# Altium project iMX53_BB_PCB_V1I1.PrjPcb (part 2 of 2)

## Sheet [08] MMC SLOT.SchDoc
size A3; CompanyName: FPT-FTI copporation; Address1: FPT Building Duy Tan; Address2: Floor 4,; DocumentNumber: 8; SheetNumber: 8; SheetTotal: 13; NameAuthor: Angle Vu
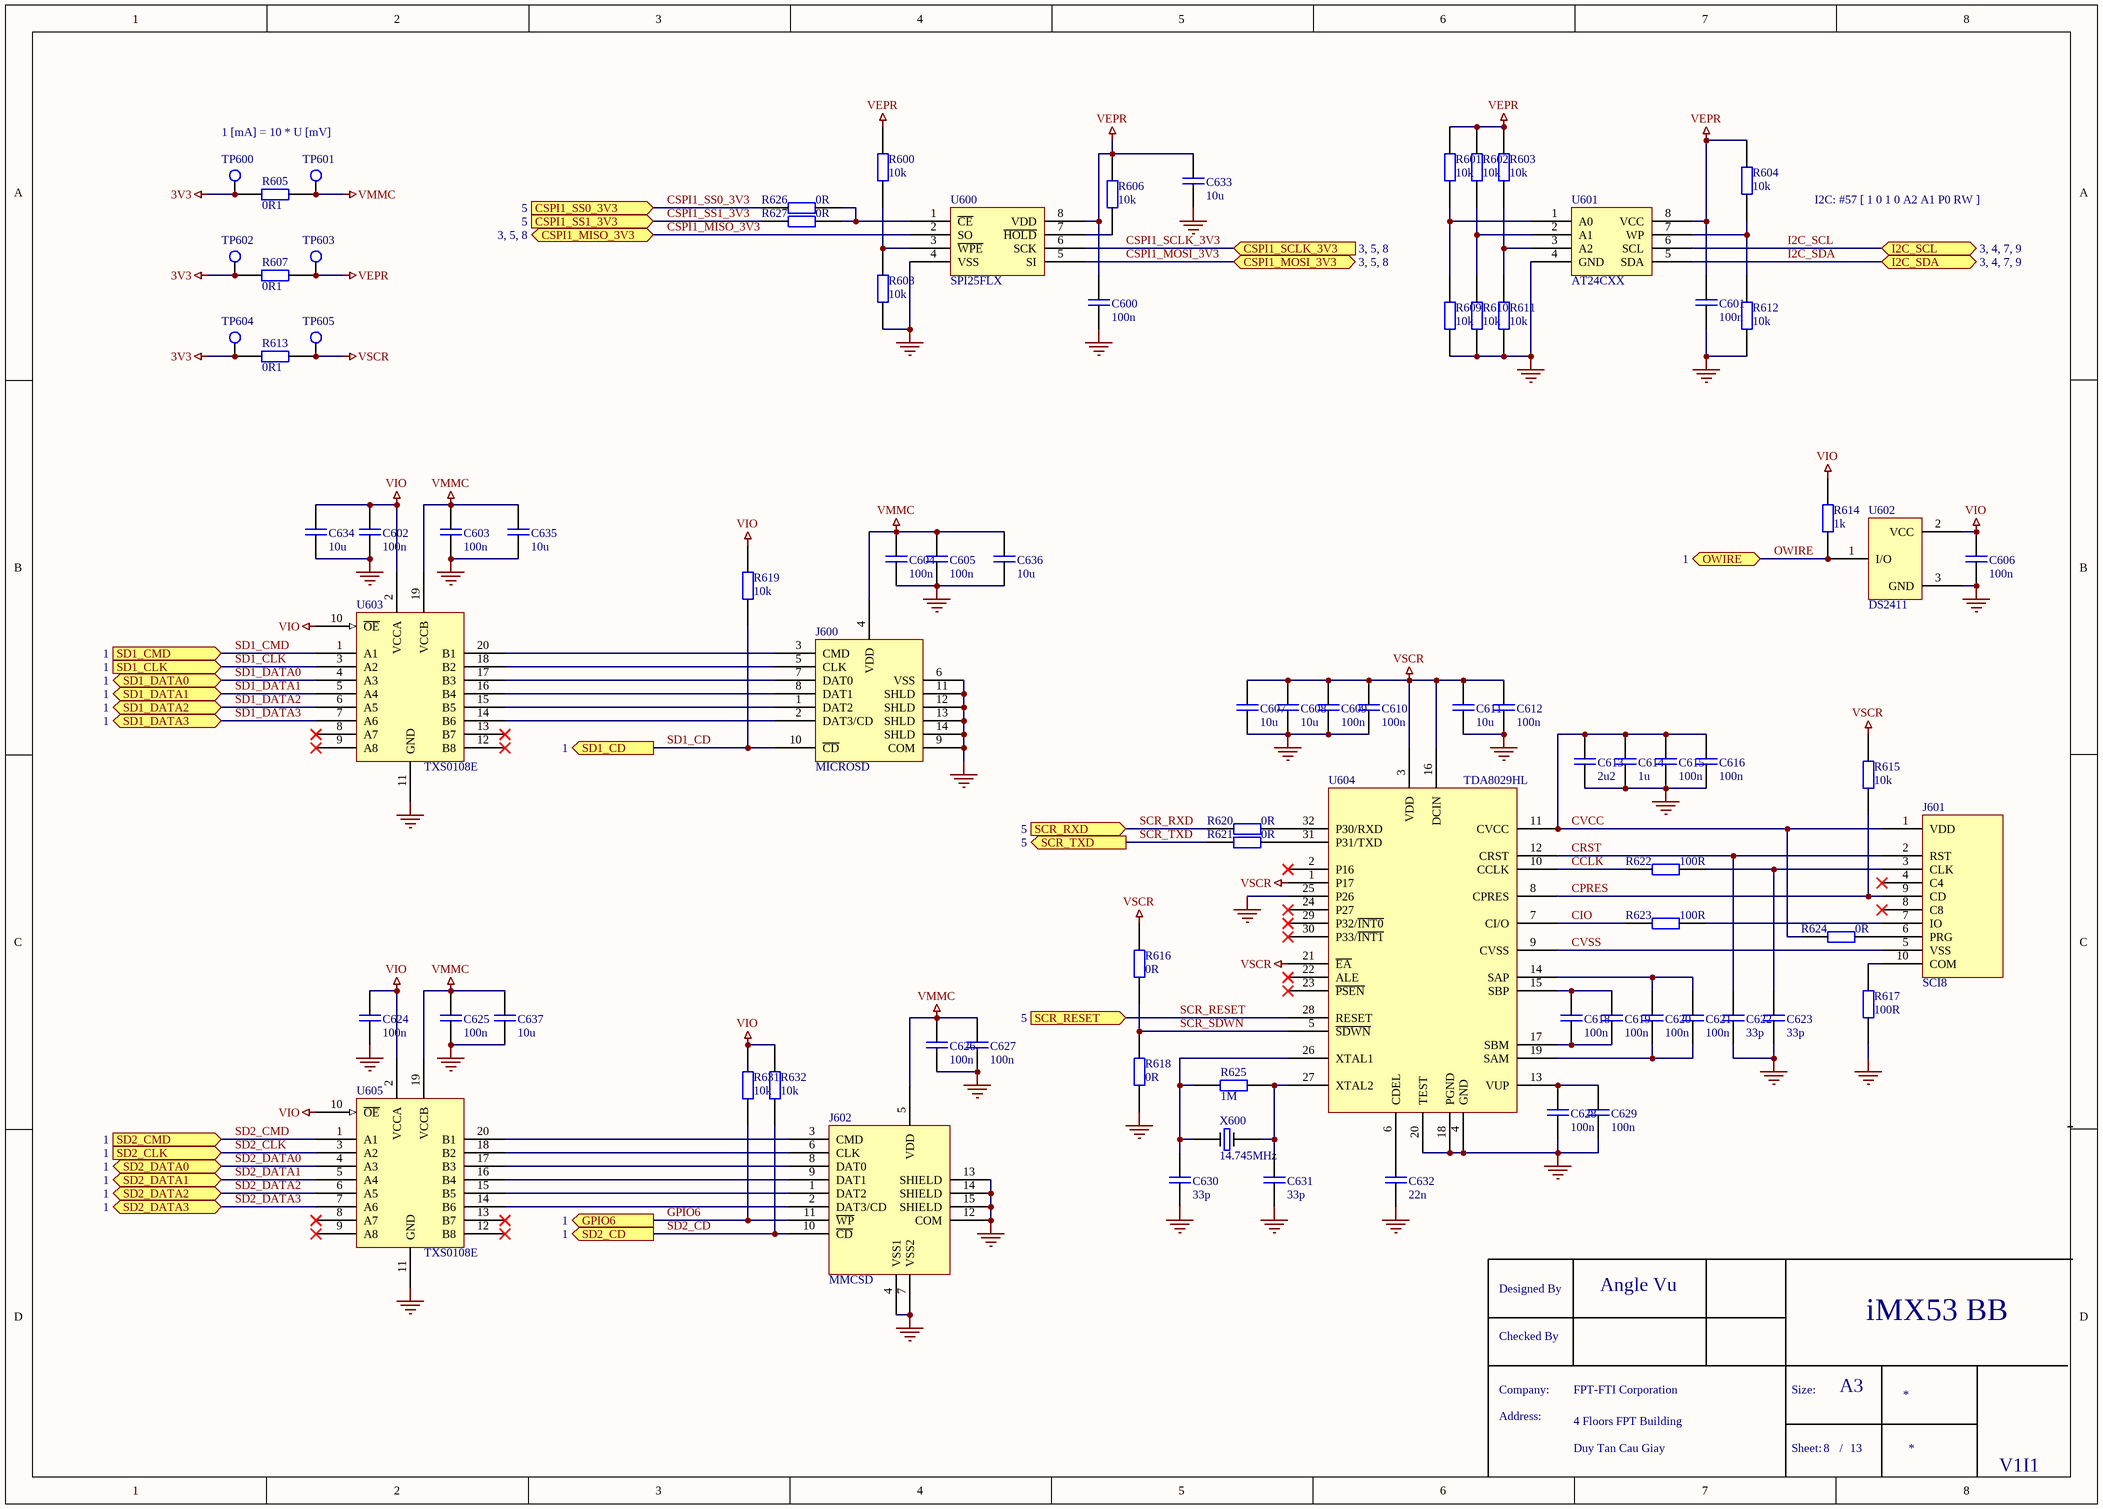
[diagram p8: [08] MMC SLOT.SchDoc]

### Parts
C600  100n  [0603]
C601  100n  [0603]
C602  100n  [0603]
C603  100n  [0603]
C604  100n  [0603]
C605  100n  [0603]
C606  100n  [0603]
C607  10u  [0805]
C608  10u  [0805]
C609  100n  [0603]
C610  100n  [0603]
C611  10u  [0805]
C612  100n  [0603]
C613  2u2  [0603]
C614  1u  [0603]
C615  100n  [0603]
C616  100n  [0603]
C618  100n  [0603]
C619  100n  [0603]
C620  100n  [0603]
C621  100n  [0603]
C622  33p  [0603]
C623  33p  [0603]
C624  100n  [0603]
C625  100n  [0603]
C626  100n  [0603]
C627  100n  [0603]
C628  100n  [0603]
C629  100n  [0603]
C630  33p  [0603]
C631  33p  [0603]
C632  22n  [0603]
C633  10u  [0805]
C634  10u  [0805]
C635  10u  [0805]
C636  10u  [0805]
C637  10u  [0805]
J600  MICROSD  [uSD10]
J601  SCI8  [SCI8F]
J602  MMCSD  [SDCMF-109]
R600  10k  [0603]
R601  10k  [0603]
R602  10k  [0603]
R603  10k  [0603]
R604  10k  [0603]
R605  0R1  [0603]
R606  10k  [0603]
R607  0R1  [0603]
R608  10k  [0603]
R609  10k  [0603]
R610  10k  [0603]
R611  10k  [0603]
R612  10k  [0603]
R613  0R1  [0603]
R614  1k  [0603]
R615  10k  [0603]
R616  0R  [0603]
R617  100R  [0603]
R618  0R  [0603]
R619  10k  [0603]
R620  0R  [0603]
R621  0R  [0603]
R622  100R  [0603]
R623  100R  [0603]
R624  0R  [0603]
R625  1M  [0603]
R626  0R  [0603]
R627  0R  [0603]
R631  10k  [0603]
R632  10k  [0603]
TP600  TESTPOINT  [TESTPOINT_2mm]  (value not drawn)
TP601  TESTPOINT  [TESTPOINT_2mm]  (value not drawn)
TP602  TESTPOINT  [TESTPOINT_2mm]  (value not drawn)
TP603  TESTPOINT  [TESTPOINT_2mm]  (value not drawn)
TP604  TESTPOINT  [TESTPOINT_2mm]  (value not drawn)
TP605  TESTPOINT  [TESTPOINT_2mm]  (value not drawn)
U600  SPI25FLX  [SOIC8]
U601  AT24CXX  [SOIC8]
U602  DS2411  [SOT23]
U603  TXS0108E  [TSSOP20]
U604  TDA8029HL  [LQFP32]
U605  TXS0108E  [TSSOP20]
X600  14.745MHz  [HC494H]

### Ports
CSPI1_MISO_3V3 (bidir, see 3, 5, 8), CSPI1_MOSI_3V3 (bidir, see 3, 5, 8), CSPI1_SCLK_3V3 (in, see 3, 5, 8), CSPI1_SS0_3V3 (in, see 5), CSPI1_SS1_3V3 (in, see 5), GPIO6 (out, see 1), I2C_SCL (bidir, see 3, 4, 7, 9), I2C_SDA (bidir, see 3, 4, 7, 9), OWIRE (bidir, see 1), SCR_RESET (in, see 5), SCR_RXD (in, see 5), SCR_TXD (out, see 5), SD1_CD (out, see 1), SD1_CLK (in, see 1), SD1_CMD (in, see 1), SD1_DATA0 (bidir, see 1), SD1_DATA1 (bidir, see 1), SD1_DATA2 (bidir, see 1), SD1_DATA3 (bidir, see 1), SD2_CD (out, see 1), SD2_CLK (in, see 1), SD2_CMD (in, see 1), SD2_DATA0 (bidir, see 1), SD2_DATA1 (bidir, see 1), SD2_DATA2 (bidir, see 1), SD2_DATA3 (bidir, see 1)

### Nets
3V3: R605.1 R607.1 R613.1 TP600.1 TP602.1 TP604.1
GND: C600.1 C601.1 C602.1 C603.1 C604.1 C605.1 C606.1 C607.1 C608.1 C609.1 C610.1 C611.1 C612.1 C613.1 C614.1 C615.1 C616.1 C622.1 C623.1 C624.1 C625.1 C626.1 C627.1 C628.1 C629.1 C630.1 C631.1 C632.1 C633.1 C634.1 C635.1 C636.1 C637.1 J600.6(VSS) J600.9(COM) J600.11(SHLD) J600.12(SHLD) J600.13(SHLD) J600.14(SHLD) J602.4(VSS1) J602.7(VSS2) J602.12(COM) J602.13(SHIELD) J602.14(SHIELD) J602.15(SHIELD) R608.2 R609.2 R610.2 R611.2 R612.2 R617.1 R618.1 U600.4(VSS) U601.4(GND) U602.3(GND) U603.11(GND) U604.4(GND) U604.18(PGND) U604.20(TEST) U604.25(P26) U605.11(GND)
VEPR: C600.2 C601.2 C633.2 R600.1 R601.1 R602.1 R603.1 R604.1 R606.1 R607.2 TP603.1 U600.8(VDD) U601.8(VCC)
VIO: C602.2 C606.2 C624.2 C634.2 R614.1 R619.1 R631.1 R632.1 U602.2(VCC) U603.2(VCCA) U603.10(~{OE}) U605.2(VCCA) U605.10(~{OE})
VMMC: C603.2 C604.2 C605.2 C625.2 C626.2 C627.2 C635.2 C636.2 C637.2 J600.4(VDD) J602.5(VDD) R605.2 TP601.1 U603.19(VCCB) U605.19(VCCB)
VSCR: C607.2 C608.2 C609.2 C610.2 C611.2 C612.2 R613.2 R615.2 R616.2 TP605.1 U604.1(P17) U604.3(VDD) U604.16(DCIN) U604.21(~{EA})
CCLK: R622.1 U604.10(CCLK)
CIO: R623.1 U604.7(CI/O)
CPRES: J601.9(CD) R615.1 U604.8(CPRES)
CRST: C622.2 J601.2(RST) U604.12(CRST)
CSPI1_MISO_3V3: U600.2(SO) ; port CSPI1_MISO_3V3
CSPI1_MOSI_3V3: U600.5(SI) ; port CSPI1_MOSI_3V3
CSPI1_SCLK_3V3: U600.6(SCK) ; port CSPI1_SCLK_3V3
CSPI1_SS0_3V3: R626.1 ; port CSPI1_SS0_3V3
CSPI1_SS1_3V3: R627.1 ; port CSPI1_SS1_3V3
CVCC: C613.2 C614.2 C615.2 C616.2 J601.1(VDD) R624.1 U604.11(CVCC)
CVSS: J601.5(VSS) U604.9(CVSS)
GPIO6: J602.11(~{WP}) R631.2 ; port GPIO6
I2C_SCL: U601.6(SCL) ; port I2C_SCL
I2C_SDA: U601.5(SDA) ; port I2C_SDA
OWIRE: R614.2 U602.1(I/O) ; port OWIRE
SCR_RESET: U604.28(RESET) ; port SCR_RESET
SCR_RXD: R620.1 ; port SCR_RXD
SCR_SDWN: R616.1 R618.2 U604.5(~{SDWN})
SCR_TXD: R621.1 ; port SCR_TXD
SD1_CD: J600.10(~{CD}) R619.2 ; port SD1_CD
SD1_CLK: U603.3(A2) ; port SD1_CLK
SD1_CMD: U603.1(A1) ; port SD1_CMD
SD1_DATA0: U603.4(A3) ; port SD1_DATA0
SD1_DATA1: U603.5(A4) ; port SD1_DATA1
SD1_DATA2: U603.6(A5) ; port SD1_DATA2
SD1_DATA3: U603.7(A6) ; port SD1_DATA3
SD2_CD: J602.10(~{CD}) R632.2 ; port SD2_CD
SD2_CLK: U605.3(A2) ; port SD2_CLK
SD2_CMD: U605.1(A1) ; port SD2_CMD
SD2_DATA0: U605.4(A3) ; port SD2_DATA0
SD2_DATA1: U605.5(A4) ; port SD2_DATA1
SD2_DATA2: U605.6(A5) ; port SD2_DATA2
SD2_DATA3: U605.7(A6) ; port SD2_DATA3
NetC618_1: C618.1 C619.1 U604.17(SBM)
NetC618_2: C618.2 C619.2 U604.15(SBP)
NetC620_1: C620.1 C621.1 U604.19(SAM)
NetC620_2: C620.2 C621.2 U604.14(SAP)
NetC623_2: C623.2 J601.3(CLK) R622.2
NetC628_2: C628.2 C629.2 U604.13(VUP)
NetC630_2: C630.2 R625.2 U604.26(XTAL1) X600.1
NetC631_2: C631.2 R625.1 U604.27(XTAL2) X600.2
NetC632_2: C632.2 U604.6(CDEL)
NetJ600_1: J600.1(DAT2) U603.15(B5)
NetJ600_2: J600.2(DAT3/CD) U603.14(B6)
NetJ600_3: J600.3(CMD) U603.20(B1)
NetJ600_5: J600.5(CLK) U603.18(B2)
NetJ600_7: J600.7(DAT0) U603.17(B3)
NetJ600_8: J600.8(DAT1) U603.16(B4)
NetJ601_6: J601.6(PRG) R624.2
NetJ601_7: J601.7(IO) R623.2
NetJ601_10: J601.10(COM) R617.2
NetJ602_1: J602.1(DAT2) U605.15(B5)
NetJ602_2: J602.2(DAT3/CD) U605.14(B6)
NetJ602_3: J602.3(CMD) U605.20(B1)
NetJ602_6: J602.6(CLK) U605.18(B2)
NetJ602_8: J602.8(DAT0) U605.17(B3)
NetJ602_9: J602.9(DAT1) U605.16(B4)
NetR600_2: R600.2 R608.1 U600.3(~{WPE})
NetR601_2: R601.2 R609.1 U601.1(A0)
NetR602_2: R602.2 R610.1 U601.2(A1)
NetR603_2: R603.2 R611.1 U601.3(A2)
NetR604_2: R604.2 R612.1 U601.7(WP)
NetR606_2: R606.2 U600.7(~{HOLD})
NetR620_2: R620.2 U604.32(P30/RXD)
NetR621_2: R621.2 U604.31(P31/TXD)
NetR626_2: R626.2 R627.2 U600.1(~{CE})

Not connected (* = marked no-connect by the designer): J601 4(C4)* 8(C8)*; U603 8(A7)* 9(A8)* 12(B8)* 13(B7)*; U604 2(P16)* 22(ALE)* 23(~{PSEN})* 24(P27)* 29(P32/~{INT0})* 30(P33/~{INT1})*; U605 8(A7)* 9(A8)* 12(B8)* 13(B7)*

### Notes on the sheet
- 1 [mA] = 10 * U [mV]
- I2C: #57 [ 1 0 1 0 A2 A1 P0 RW ]
- Designed By
- Checked By
- Company:
- Size:
- A3
- Address:
- Sheet:
- /

### Library data of the parts
C600-C616 C618-C637 = C
R600-R627 R631 R632 = R
TP600-TP605 = TESTPOINT: Testpoint pad; Order number: no component; Component class: TP; Producer: n/a; Assembly type: no component
X600 = XTAL

## Sheet [09] - DVI.SchDoc
size A3; CompanyName: FPT-FTI copporation; Address1: FPT Building Duy Tan; Address2: Floor 4,; DocumentNumber: 9; SheetNumber: 9; SheetTotal: 13; NameAuthor: Angle Vu
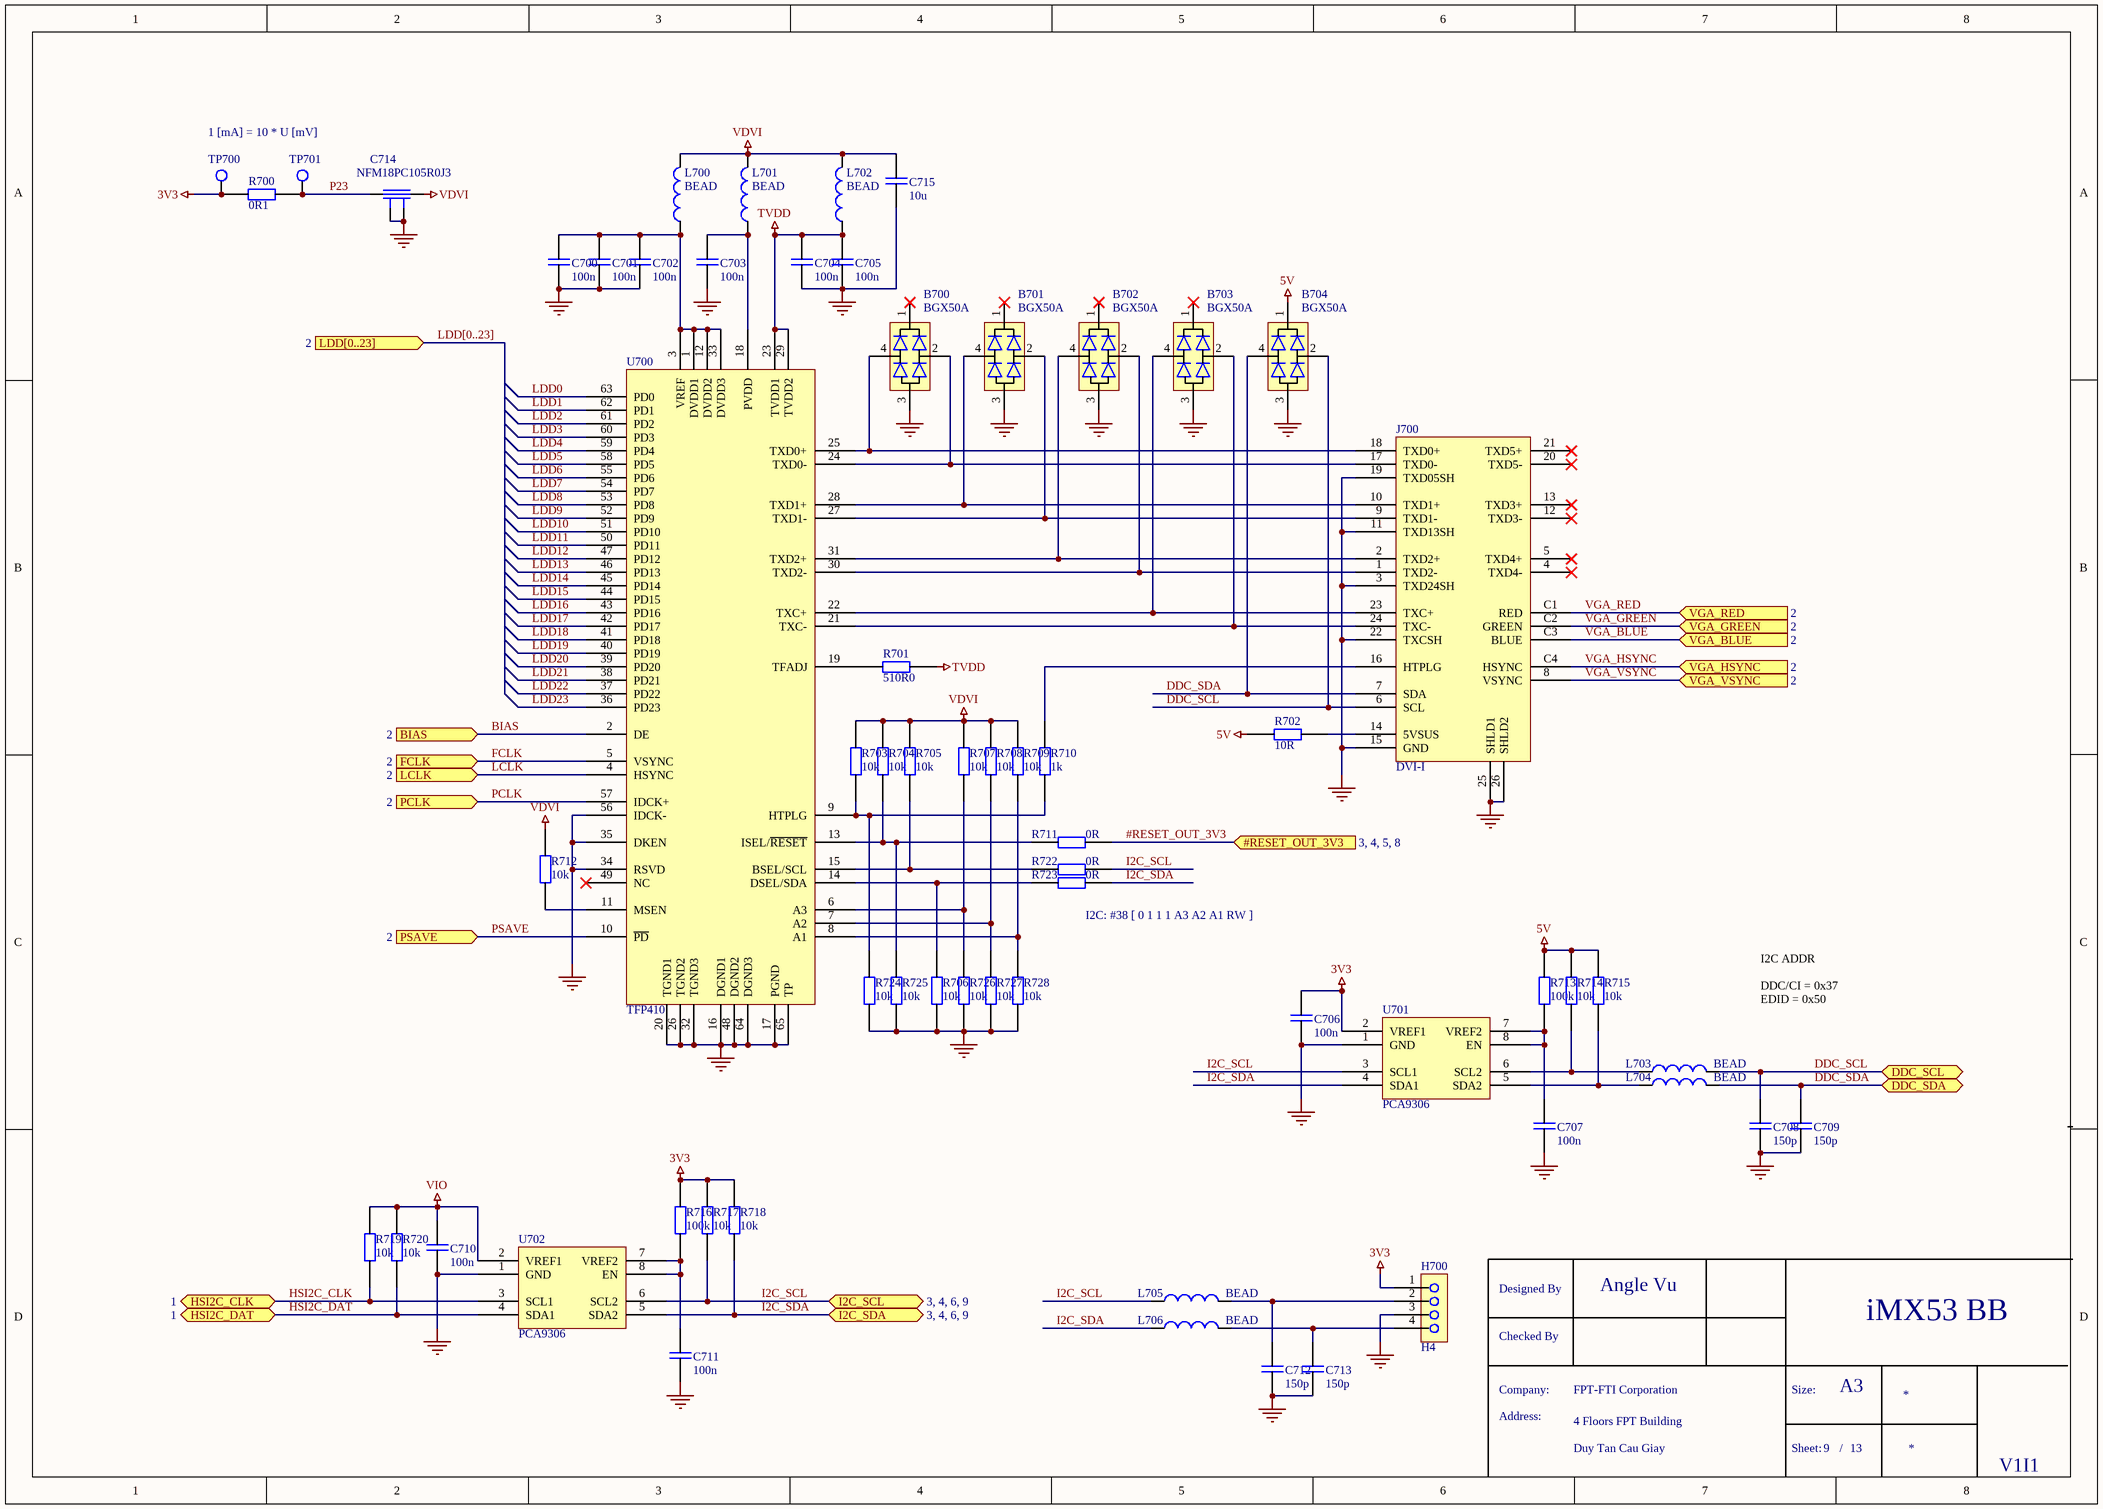
[diagram p9: [09] - DVI.SchDoc]

### Parts
B700  BGX50A  [SOT143]
B701  BGX50A  [SOT143]
B702  BGX50A  [SOT143]
B703  BGX50A  [SOT143]
B704  BGX50A  [SOT143]
C700  100n  [0603]
C701  100n  [0603]
C702  100n  [0603]
C703  100n  [0603]
C704  100n  [0603]
C705  100n  [0603]
C706  100n  [0603]
C707  100n  [0603]
C708  150p  [0603]
C709  150p  [0603]
C710  100n  [0603]
C711  100n  [0603]
C712  150p  [0603]
C713  150p  [0603]
C714  NFM18PC105R0J3  [NFM18P]
C715  10u  [0805]
H700  H4  [H1x4]
J700  DVI-I  [DVI_F_RA]
L700  BEAD  [0603]
L701  BEAD  [0603]
L702  BEAD  [0603]
L703  BEAD  [0603]
L704  BEAD  [0603]
L705  BEAD  [0603]
L706  BEAD  [0603]
R700  0R1  [0603]
R701  510R0  [0603]
R702  10R  [0603]
R703  10k  [0603]
R704  10k  [0603]
R705  10k  [0603]
R706  10k  [0603]
R707  10k  [0603]
R708  10k  [0603]
R709  10k  [0603]
R710  1k  [0603]
R711  0R  [0603]
R712  10k  [0603]
R713  100k  [0603]
R714  10k  [0603]
R715  10k  [0603]
R716  100k  [0603]
R717  10k  [0603]
R718  10k  [0603]
R719  10k  [0603]
R720  10k  [0603]
R722  0R  [0603]
R723  0R  [0603]
R724  10k  [0603]
R725  10k  [0603]
R726  10k  [0603]
R727  10k  [0603]
R728  10k  [0603]
TP700  TESTPOINT  [TESTPOINT_2mm]  (value not drawn)
TP701  TESTPOINT  [TESTPOINT_2mm]  (value not drawn)
U700  TFP410  [TQFP64]
U701  PCA9306  [TSSOP8]
U702  PCA9306  [TSSOP8]

### Ports
#RESET_OUT_3V3 (in, see 3, 4, 5, 8), BIAS (in, see 2), DDC_SCL (bidir), DDC_SDA (bidir), FCLK (in, see 2), HSI2C_CLK (bidir, see 1), HSI2C_DAT (bidir, see 1), I2C_SCL (bidir, see 3, 4, 6, 9), I2C_SDA (bidir, see 3, 4, 6, 9), LCLK (in, see 2), LDD[0..23] (in, see 2), PCLK (in, see 2), PSAVE (in, see 2), VGA_BLUE (in, see 2), VGA_GREEN (in, see 2), VGA_HSYNC (in, see 2), VGA_RED (in, see 2), VGA_VSYNC (in, see 2)

### Nets
3V3: C706.2 H700.1 R700.1 R716.1 R717.1 R718.1 TP700.1 U701.2(VREF1)
5V: B704.1 R702.2 R713.1 R714.1 R715.1
GND: B700.3 B701.3 B702.3 B703.3 B704.3 C700.1 C701.1 C702.1 C703.1 C704.1 C705.1 C706.1 C707.1 C708.1 C709.1 C710.1 C711.1 C712.1 C713.1 C714.2 C714.4 C715.1 H700.3 J700.3(TXD24SH) J700.11(TXD13SH) J700.15(GND) J700.19(TXD05SH) J700.22(TXCSH) J700.25(SHLD1) J700.26(SHLD2) R706.1 R724.2 R725.2 R726.2 R727.2 R728.2 U700.16(DGND1) U700.17(PGND) U700.20(TGND1) U700.26(TGND2) U700.32(TGND3) U700.34(RSVD) U700.35(DKEN) U700.48(DGND2) U700.56(IDCK-) U700.64(DGND3) U700.65(TP) U701.1(GND) U702.1(GND)
TVDD: C704.2 C705.2 L702.1 R701.1 U700.23(TVDD1) U700.29(TVDD2)
VDVI: C714.3 C715.2 L700.2 L701.2 L702.2 R703.1 R704.1 R705.1 R707.1 R708.1 R709.1 R712.1
VIO: C710.2 R719.1 R720.1 U702.2(VREF1)
#RESET_OUT_3V3: R711.1 ; port #RESET_OUT_3V3
BIAS: U700.2(DE) ; port BIAS
DDC_SCL: B704.2 C708.2 J700.6(SCL) L703.2 ; port DDC_SCL
DDC_SDA: B704.4 C709.2 J700.7(SDA) L704.2 ; port DDC_SDA
FCLK: U700.5(VSYNC) ; port FCLK
HSI2C_CLK: R719.2 U702.3(SCL1) ; port HSI2C_CLK
HSI2C_DAT: R720.2 U702.4(SDA1) ; port HSI2C_DAT
I2C_SCL: L705.1 R717.2 R722.1 U701.3(SCL1) U702.6(SCL2) ; port I2C_SCL
I2C_SDA: L706.1 R718.2 R723.1 U701.4(SDA1) U702.5(SDA2) ; port I2C_SDA
LCLK: U700.4(HSYNC) ; port LCLK
LDD0: U700.63(PD0)
LDD1: U700.62(PD1)
LDD2: U700.61(PD2)
LDD3: U700.60(PD3)
LDD4: U700.59(PD4)
LDD5: U700.58(PD5)
LDD6: U700.55(PD6)
LDD7: U700.54(PD7)
LDD8: U700.53(PD8)
LDD9: U700.52(PD9)
LDD10: U700.51(PD10)
LDD11: U700.50(PD11)
LDD12: U700.47(PD12)
LDD13: U700.46(PD13)
LDD14: U700.45(PD14)
LDD15: U700.44(PD15)
LDD16: U700.43(PD16)
LDD17: U700.42(PD17)
LDD18: U700.41(PD18)
LDD19: U700.40(PD19)
LDD20: U700.39(PD20)
LDD21: U700.38(PD21)
LDD22: U700.37(PD22)
LDD23: U700.36(PD23)
P23: C714.1 R700.2 TP701.1
PCLK: U700.57(IDCK+) ; port PCLK
PSAVE: U700.10(~{PD}) ; port PSAVE
VGA_BLUE: J700.C3(BLUE) ; port VGA_BLUE
VGA_GREEN: J700.C2(GREEN) ; port VGA_GREEN
VGA_HSYNC: J700.C4(HSYNC) ; port VGA_HSYNC
VGA_RED: J700.C1(RED) ; port VGA_RED
VGA_VSYNC: J700.8(VSYNC) ; port VGA_VSYNC
NetB700_2: B700.2 J700.17(TXD0-) U700.24(TXD0-)
NetB700_4: B700.4 J700.18(TXD0+) U700.25(TXD0+)
NetB701_2: B701.2 J700.9(TXD1-) U700.27(TXD1-)
NetB701_4: B701.4 J700.10(TXD1+) U700.28(TXD1+)
NetB702_2: B702.2 J700.1(TXD2-) U700.30(TXD2-)
NetB702_4: B702.4 J700.2(TXD2+) U700.31(TXD2+)
NetB703_2: B703.2 J700.24(TXC-) U700.21(TXC-)
NetB703_4: B703.4 J700.23(TXC+) U700.22(TXC+)
NetC700_2: C700.2 C701.2 C702.2 L700.1 U700.1(DVDD1) U700.3(VREF) U700.12(DVDD2) U700.33(DVDD3)
NetC703_2: C703.2 L701.1 U700.18(PVDD)
NetC707_2: C707.2 R713.2 U701.7(VREF2) U701.8(EN)
NetC711_2: C711.2 R716.2 U702.7(VREF2) U702.8(EN)
NetC712_2: C712.2 H700.2 L705.2
NetC713_2: C713.2 H700.4 L706.2
NetJ700_14: J700.14(5VSUS) R702.1
NetJ700_16: J700.16(HTPLG) R710.1
NetL703_1: L703.1 R714.2 U701.6(SCL2)
NetL704_1: L704.1 R715.2 U701.5(SDA2)
NetR701_2: R701.2 U700.19(TFADJ)
NetR703_2: R703.2 R710.2 R724.1 U700.9(HTPLG)
NetR704_2: R704.2 R711.2 R725.1 U700.13(ISEL/~{RESET})
NetR705_2: R705.2 R722.2 U700.15(BSEL/SCL)
NetR706_2: R706.2 R723.2 U700.14(DSEL/SDA)
NetR707_2: R707.2 R726.1 U700.6(A3)
NetR708_2: R708.2 R727.1 U700.7(A2)
NetR709_2: R709.2 R728.1 U700.8(A1)
NetR712_2: R712.2 U700.11(MSEN)

Not connected (* = marked no-connect by the designer): B700 1*; B701 1*; B702 1*; B703 1*; J700 4(TXD4-)* 5(TXD4+)* 12(TXD3-)* 13(TXD3+)* 20(TXD5-)* 21(TXD5+)*; U700 49(NC)*

### Buses and harness runs
bus LDD[0..23] = port LDD[0..23]

### Notes on the sheet
- 1 [mA] = 10 * U [mV]
- I2C: #38 [ 0 1 1 1 A3 A2 A1 RW ]
- I2C ADDR
  DDC/CI	= 0x37
  EDID	= 0x50
- Designed By
- Checked By
- Company:
- Size:
- A3
- Address:
- Sheet:
- /

### Library data of the parts
C700-C713 C715 = C
C714 = NFL21S: Chip EMIFIL; Producer: Murata; Order number: NFM18PC105R0J3; Component class: C; Assembly type: SMT
L700-L706 = FBEAD
R700-R720 R722-R728 = R
TP700 TP701 = TESTPOINT: as TP600-TP605 on sheet [08] MMC SLOT; Component class: TP; Producer: n/a; Assembly type: no component

## Sheet [10] - ETHERNET.SchDoc
size A3; CompanyName: FPT-FTI copporation; Address1: FPT Building Duy Tan; Address2: Floor 4,; DocumentNumber: 10; SheetNumber: 10; SheetTotal: 13; NameAuthor: Angle Vu
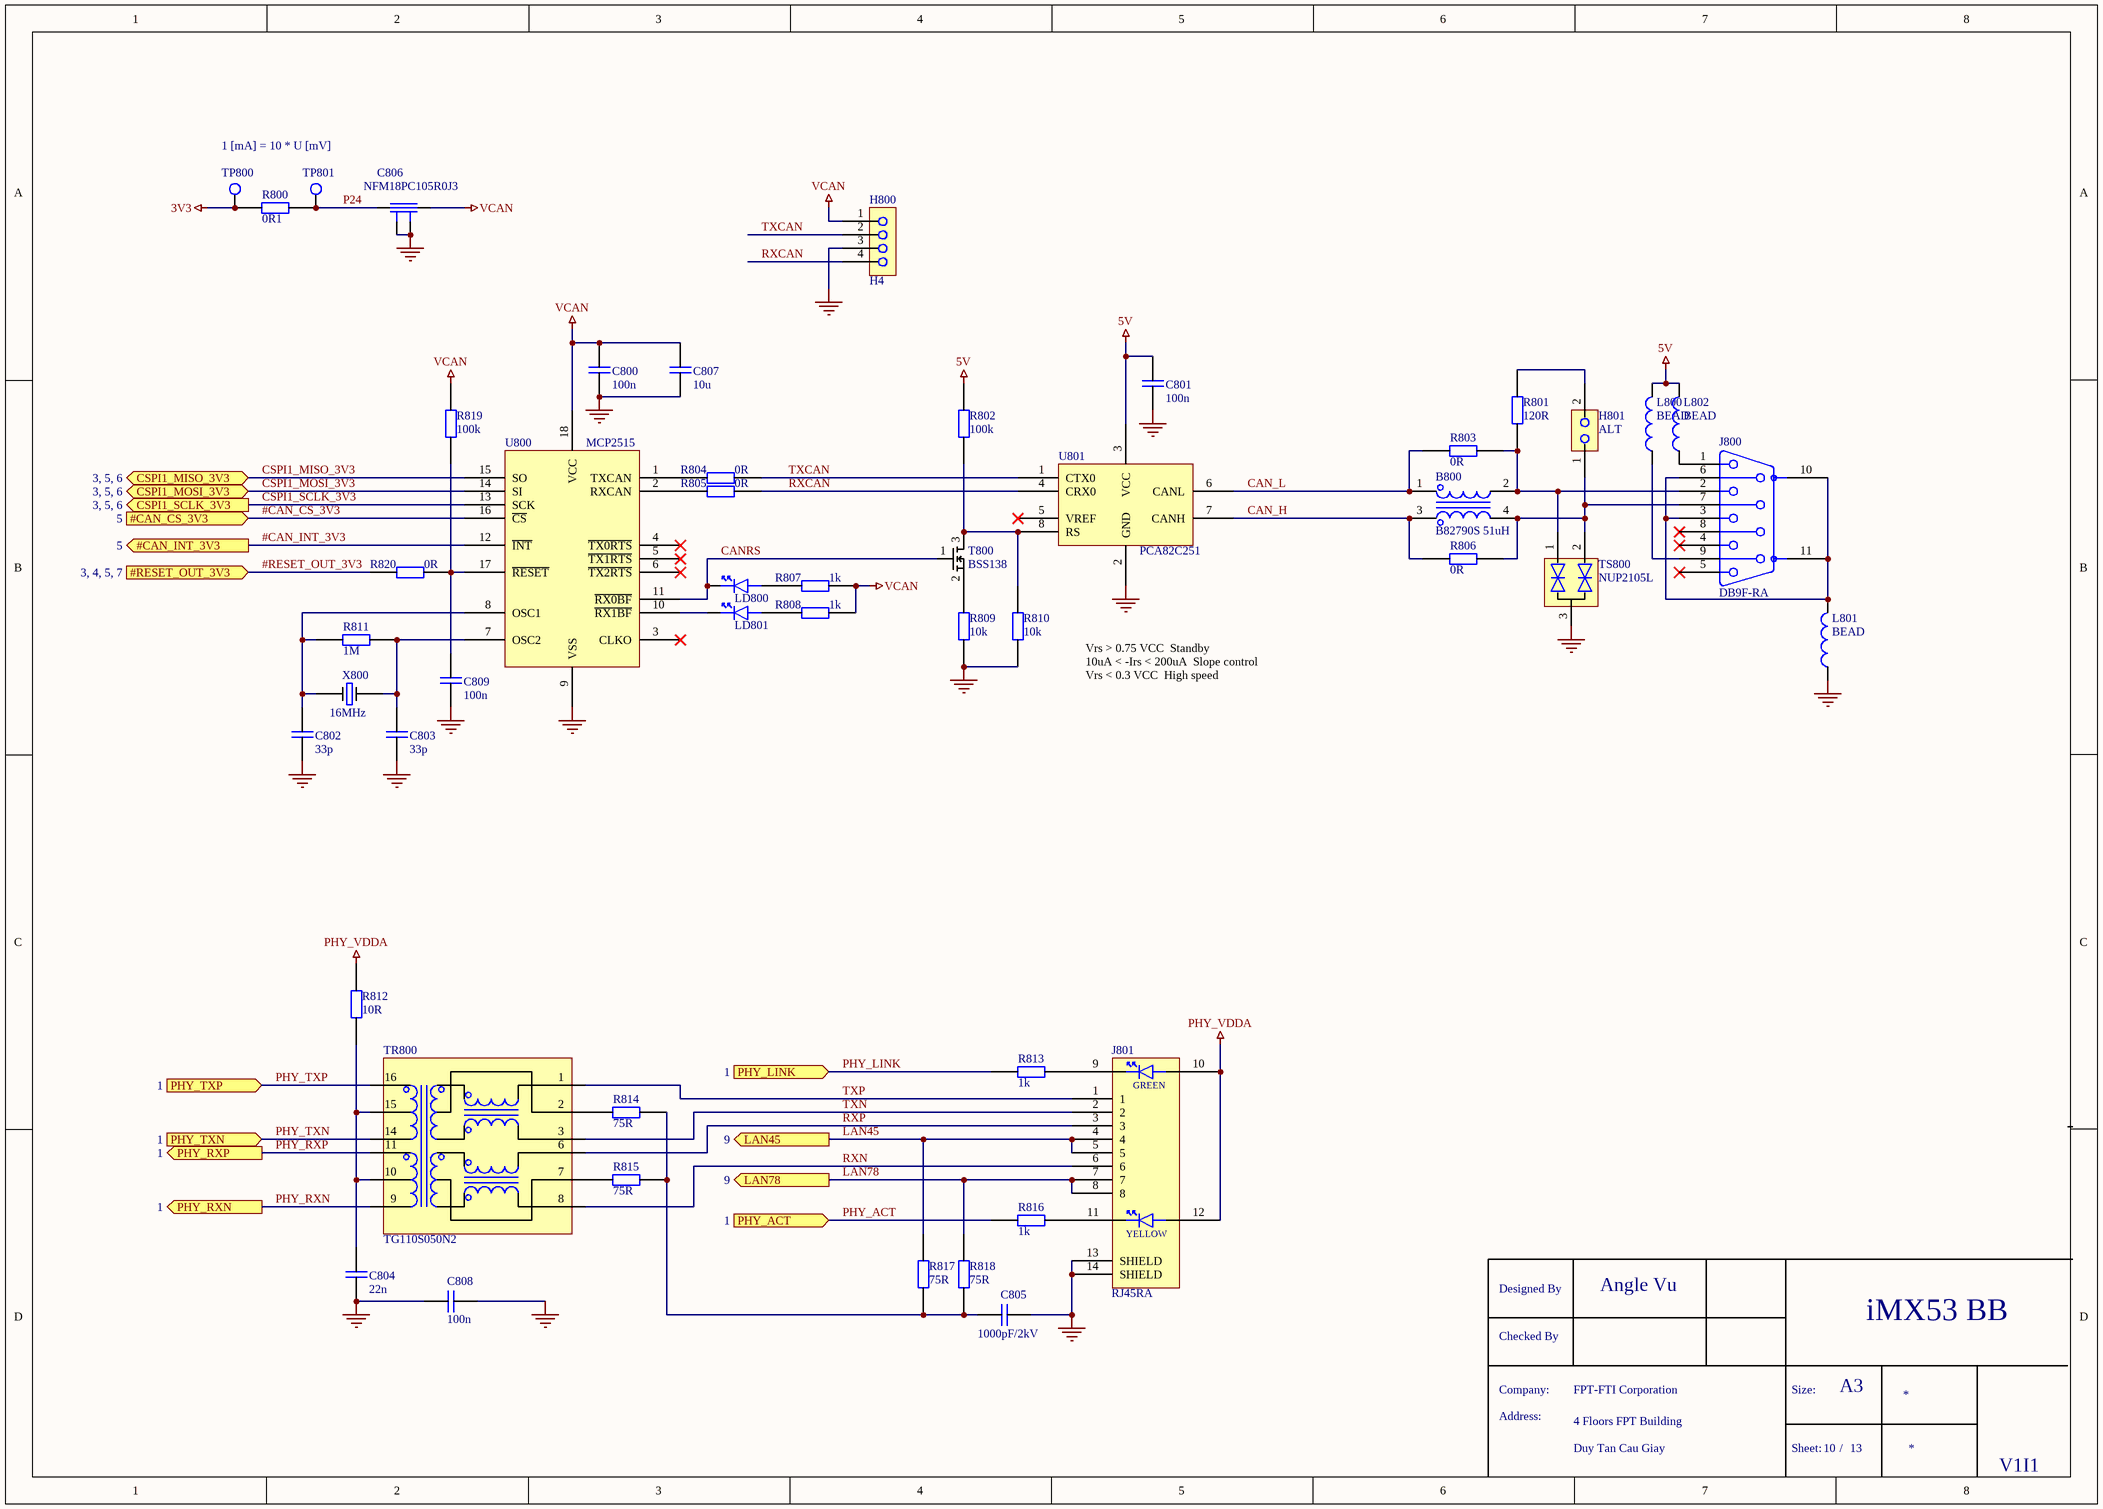
[diagram p10: [10] - ETHERNET.SchDoc]

### Parts
B800  B82790S 51uH  [B82790]
C800  100n  [0603]
C801  100n  [0603]
C802  33p  [0603]
C803  33p  [0603]
C804  22n  [0603]
C805  1000pF/2kV  [1n]
C806  NFM18PC105R0J3  [NFM18P]
C807  10u  [0805]
C808  100n  [0603]
C809  100n  [0603]
H800  H4  [H1x4]
H801  ALT  [H1x2]
J800  DB9F-RA  [DRA9_F]
J801  RJ45RA  [RJ45LED]
L800  BEAD  [0805]
L801  BEAD  [0603]
L802  BEAD  [0805]
LD800  LED  [0805]  (value not drawn)
LD801  LED  [0805]  (value not drawn)
R800  0R1  [0603]
R801  120R  [0603]
R802  100k  [0603]
R803  0R  [0603]
R804  0R  [0603]
R805  0R  [0603]
R806  0R  [0603]
R807  1k  [0603]
R808  1k  [0603]
R809  10k  [0603]
R810  10k  [0603]
R811  1M  [0603]
R812  10R  [0603]
R813  1k  [0603]
R814  75R  [0603]
R815  75R  [0603]
R816  1k  [0603]
R817  75R  [0603]
R818  75R  [0603]
R819  100k  [0603]
R820  0R  [0603]
T800  BSS138  [SOT23]
TP800  TESTPOINT  [TESTPOINT_2mm]  (value not drawn)
TP801  TESTPOINT  [TESTPOINT_2mm]  (value not drawn)
TR800  TG110S050N2  [SOIC16M]
TS800  NUP2105L  [SOT23]
U800  MCP2515  [SOIC18W]
U801  PCA82C251  [SOIC8N]
X800  16MHz  [HC494H]

### Ports
#CAN_CS_3V3 (in, see 5), #CAN_INT_3V3 (out, see 5), #RESET_OUT_3V3 (in, see 3, 4, 5, 7), CSPI1_MISO_3V3 (bidir, see 3, 5, 6), CSPI1_MOSI_3V3 (bidir, see 3, 5, 6), CSPI1_SCLK_3V3 (out, see 3, 5, 6), LAN45 (out, see 9), LAN78 (out, see 9), PHY_ACT (in, see 1), PHY_LINK (in, see 1), PHY_RXN (out, see 1), PHY_RXP (out, see 1), PHY_TXN (in, see 1), PHY_TXP (in, see 1)

### Nets
3V3: R800.1 TP800.1
5V: C801.2 L800.2 L802.2 R802.1 U801.3(VCC)
CASE_GND: C805.2 C808.1 J801.13(SHIELD) J801.14(SHIELD)
GND: C800.1 C801.1 C802.1 C803.1 C804.1 C806.2 C806.4 C807.1 C808.2 C809.1 H800.3 L801.1 R809.2 R810.2 TS800.3 U800.9(VSS) U801.2(GND)
PHY_VDDA: J801.10(D1P) J801.12(D2P) R812.2
VCAN: C800.2 C806.3 C807.2 H800.1 R807.1 R808.1 R819.1 U800.18(VCC)
#CAN_CS_3V3: U800.16(~{CS}) ; port #CAN_CS_3V3
#CAN_INT_3V3: U800.12(~{INT}) ; port #CAN_INT_3V3
#RESET_OUT_3V3: R820.2 ; port #RESET_OUT_3V3
CAN_H: B800.3 R806.1 U801.7(CANH)
CAN_L: B800.1 R803.1 U801.6(CANL)
CANRS: LD800.2(CATHODE) T800.1(G) U800.11(~{RX0BF})
CSPI1_MISO_3V3: U800.15(SO) ; port CSPI1_MISO_3V3
CSPI1_MOSI_3V3: U800.14(SI) ; port CSPI1_MOSI_3V3
CSPI1_SCLK_3V3: U800.13(SCK) ; port CSPI1_SCLK_3V3
LAN45: J801.4 J801.5 R817.2 ; port LAN45
LAN78: J801.7 J801.8 R818.2 ; port LAN78
P24: C806.1 R800.2 TP801.1
PHY_ACT: R816.1 ; port PHY_ACT
PHY_LINK: R813.1 ; port PHY_LINK
PHY_RXN: TR800.9(P10) ; port PHY_RXN
PHY_RXP: TR800.11(P12) ; port PHY_RXP
PHY_TXN: TR800.14(P14) ; port PHY_TXN
PHY_TXP: TR800.16(P16) ; port PHY_TXP
RXCAN: H800.4 R805.1 U801.4(CRX0)
RXN: J801.6 TR800.8(P8)
RXP: J801.3 TR800.6(P6)
TXCAN: H800.2 R804.1 U801.1(CTX0)
TXN: J801.2 TR800.3(P3)
TXP: J801.1 TR800.1(P1)
NetB800_2: B800.2 J800.2 R801.2 R803.2 TS800.1
NetB800_4: B800.4 H801.1 J800.7 R806.2 TS800.2
NetC802_2: C802.2 R811.2 U800.8(OSC1) X800.1
NetC803_2: C803.2 R811.1 U800.7(OSC2) X800.2
NetC804_2: C804.2 R812.1 TR800.10(P11) TR800.15(CT)
NetC805_1: C805.1 R814.2 R815.2 R817.1 R818.1
NetC809_2: C809.2 R819.2 R820.1 U800.17(~{RESET})
NetH801_2: H801.2 R801.1
NetJ800_1: J800.1 L802.1
NetJ800_3: J800.3 J800.6 J800.10(SHIELD) J800.11(SHIELD) L801.2
NetJ800_9: J800.9 L800.1
NetJ801_9: J801.9(D1N) R813.2
NetJ801_11: J801.11(D2N) R816.2
NetLD800_1: LD800.1(ANODE) R807.2
NetLD801_1: LD801.1(ANODE) R808.2
NetLD801_2: LD801.2(CATHODE) U800.10(~{RX1BF})
NetR802_2: R802.2 R810.1 T800.3(D) U801.8(RS)
NetR804_2: R804.2 U800.1(TXCAN)
NetR805_2: R805.2 U800.2(RXCAN)
NetR809_1: R809.1 T800.2(S)
NetR814_1: R814.1 TR800.2(P2)
NetR815_1: R815.1 TR800.7(P7)

Not connected (* = marked no-connect by the designer): J800 4* 5* 8*; U800 3(CLKO)* 4(~{TX0RTS})* 5(~{TX1RTS})* 6(~{TX2RTS})*; U801 5(VREF)*

### Notes on the sheet
- 1 [mA] = 10 * U [mV]
- Vrs > 0.75 VCC		Standby
  10uA < -Irs < 200uA		Slope control
  Vrs < 0.3 VCC		High speed
- Designed By
- Checked By
- Company:
- Size:
- A3
- Address:
- Sheet:
- /
- (in symbol RJ45RA) GREEN; YELLOW

### Library data of the parts
B800 = B82790S: pin to pad: 3>4 4>3
C800-C805 C807-C809 = C
C806 = NFL21S: Chip EMIFIL; Producer: Murata; Order number: NFM18PC105R0J3; Component class: C; Assembly type: SMT
H801 = H2
L800-L802 = FBEAD
R800-R820 = R
TP800 TP801 = TESTPOINT: as TP600-TP605 on sheet [08] MMC SLOT; Component class: TP; Producer: n/a; Assembly type: no component
X800 = XTAL

## Sheet [11] - POWERS.SchDoc
size A3; CompanyName: FPT-FTI copporation; Address1: FPT Building Duy Tan; Address2: Floor 4,; DocumentNumber: 11; SheetNumber: 11; SheetTotal: 13; NameAuthor: Angle Vu
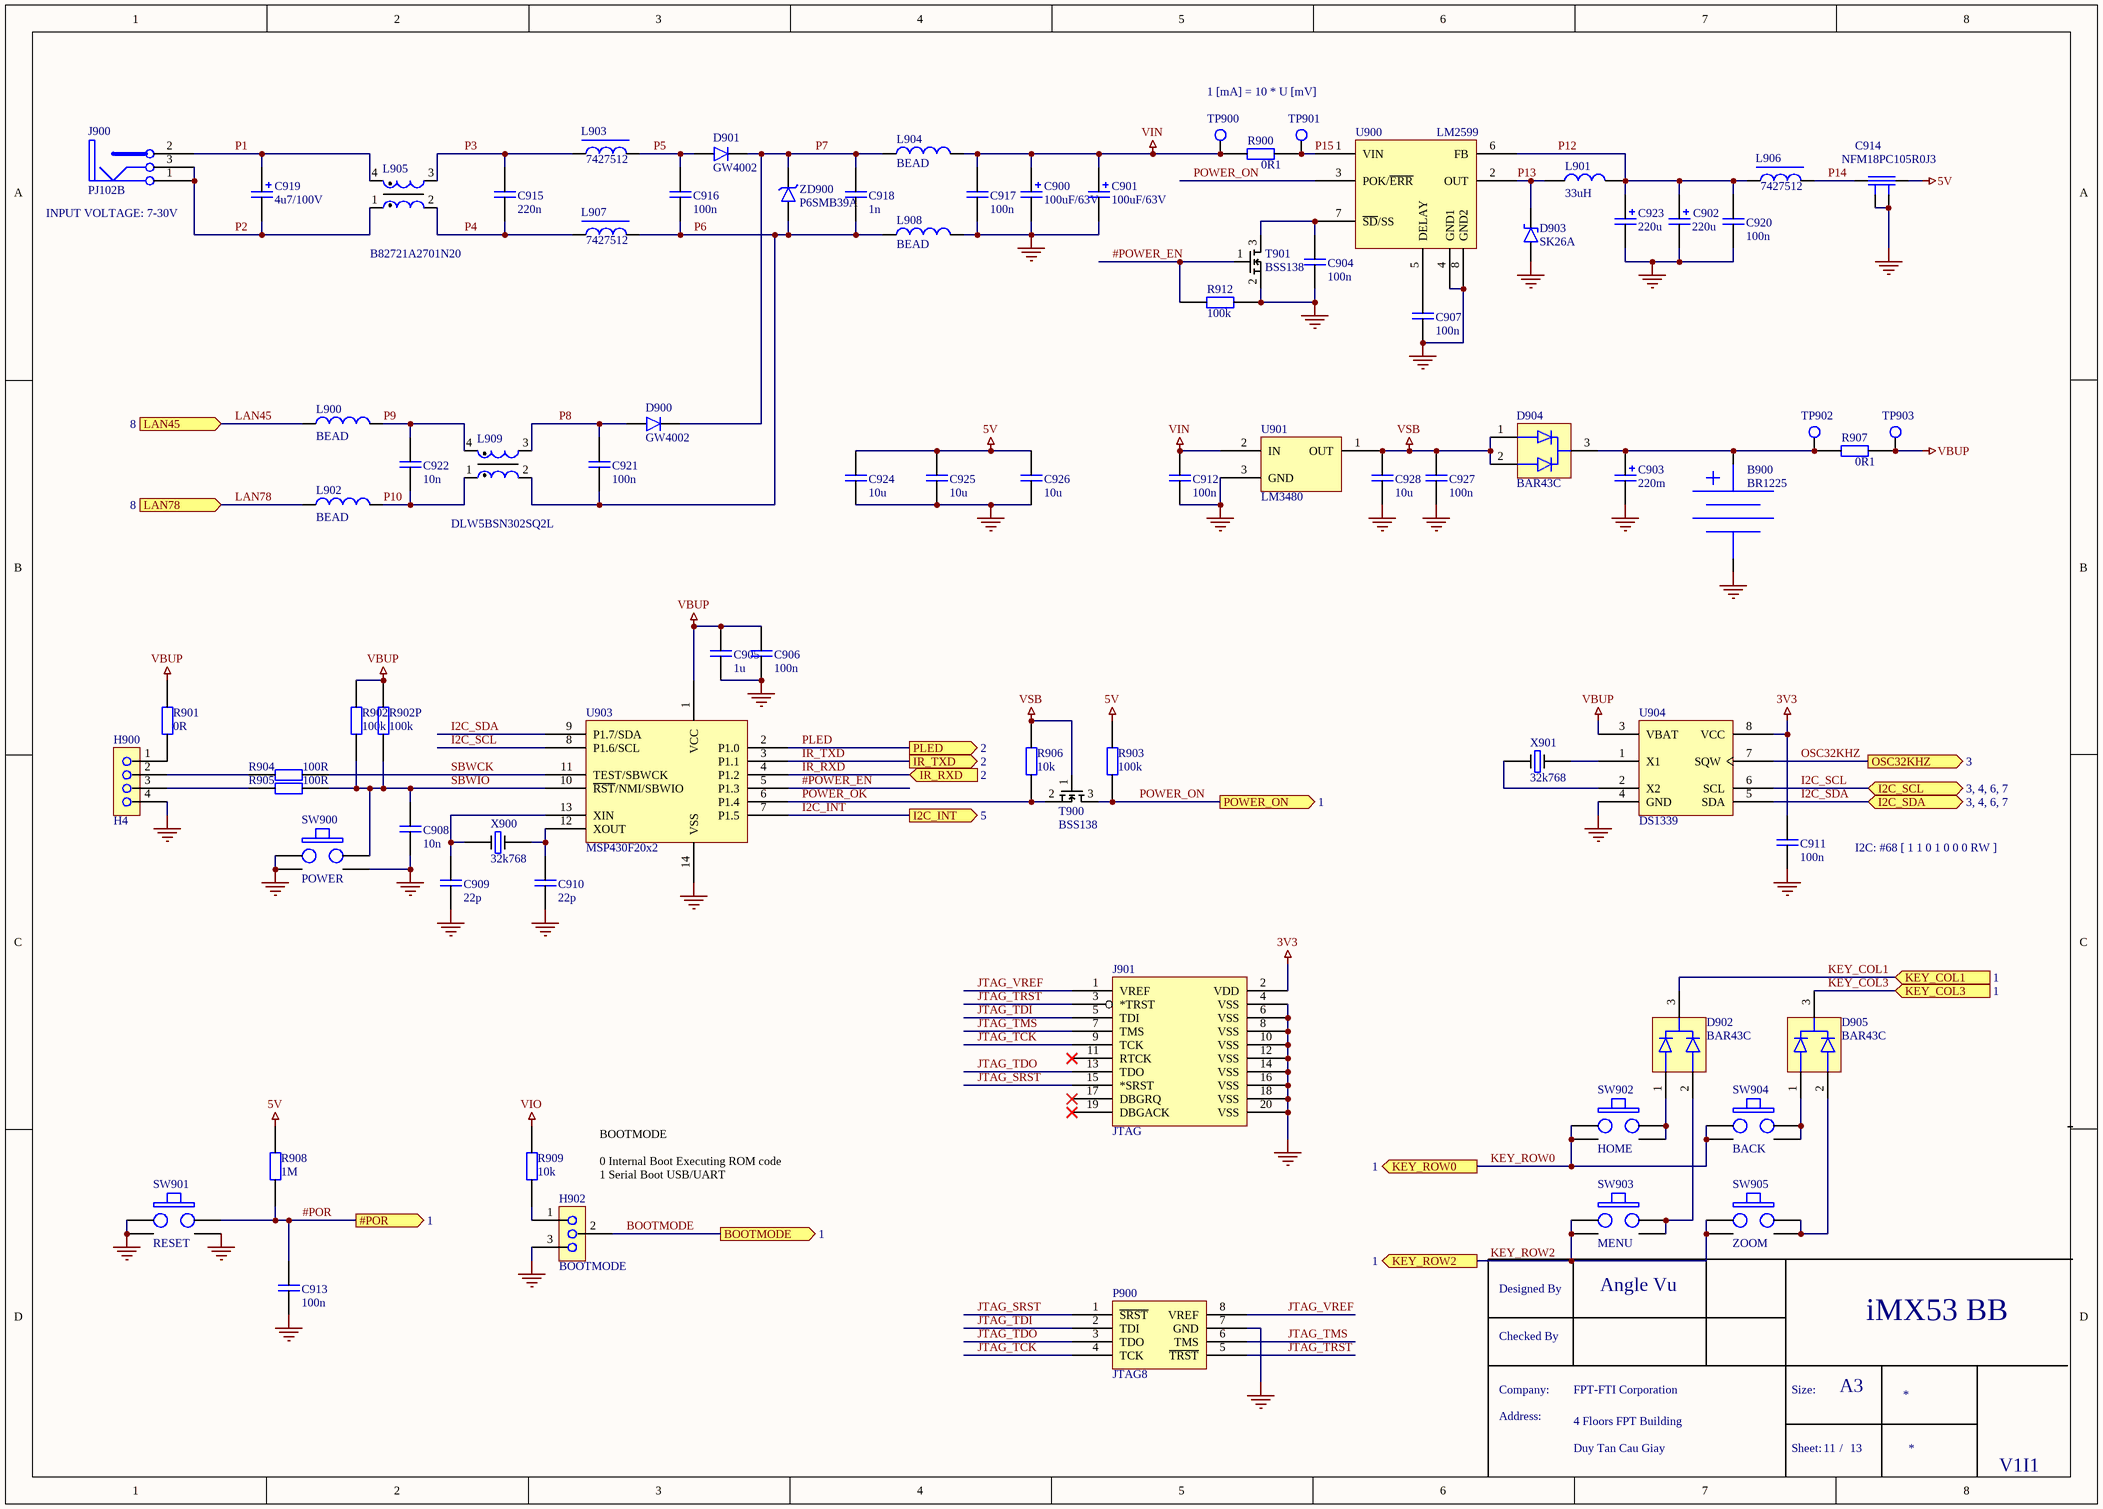
[diagram p11: [11] - POWERS.SchDoc]

### Parts
B900  BR1225  [BR1225]
C900  100uF/63V  [EC5/10]
C901  100uF/63V  [EC5/10]
C902  220u  [EC5/10]
C903  220m  [SC5/13]
C904  100n  [0603]
C905  1u  [0603]
C906  100n  [0603]
C907  100n  [0603]
C908  10n  [0603]
C909  22p  [0603]
C910  22p  [0603]
C911  100n  [0603]
C912  100n  [0603]
C913  100n  [0603]
C914  NFM18PC105R0J3  [NFM18P]
C915  220n  [1206]
C916  100n  [1206]
C917  100n  [1206]
C918  1n  [0805]
C919  4u7/100V  [EC2/5]
C920  100n  [0603]
C921  100n  [0603]
C922  10n  [0603]
C923  220u  [EC5/10]
C924  10u  [0805]
C925  10u  [0805]
C926  10u  [0805]
C927  100n  [0603]
C928  10u  [0805]
D900  GW4002  [MELF]
D901  GW4002  [MELF]
D902  BAR43C  [SOT23]
D903  SK26A  [SMB]
D904  BAR43C  [SOT23]
D905  BAR43C  [SOT23]
H900  H4  [H1x4]
H902  BOOTMODE  [H1x3]
J900  PJ102B  [POWER_JACK_5.5/2.1MM_NS]
J901  JTAG  [H2x10]
L900  BEAD  [0805]
L901  33uH  [L127_NS]
L902  BEAD  [0805]
L903  7427512  [7427512]
L904  BEAD  [0805]
L905  B82721A2701N20  [42H17]
L906  7427512  [7427512]
L907  7427512  [7427512]
L908  BEAD  [0805]
L909  DLW5BSN302SQ2L  [DLW5BSN]
P900  JTAG8  [47041-0001]
R900  0R1  [0603]
R901  0R  [0603]
R902  100k  [0603]
R902P  100k  [0603]
R903  100k  [0603]
R904  100R  [0603]
R905  100R  [0603]
R906  10k  [0603]
R907  0R1  [0603]
R908  1M  [0603]
R909  10k  [0603]
R912  100k  [0603]
SW900  POWER  [BUTTON_RA_NS]
SW901  RESET  [BUTTON_RA_NS]
SW902  HOME  [BUTTON_KSM61X]
SW903  MENU  [BUTTON_KSM61X]
SW904  BACK  [BUTTON_KSM61X]
SW905  ZOOM  [BUTTON_KSM61X]
T900  BSS138  [SOT23]
T901  BSS138  [SOT23]
TP900  TESTPOINT  [TESTPOINT_2mm]  (value not drawn)
TP901  TESTPOINT  [TESTPOINT_2mm]  (value not drawn)
TP902  TESTPOINT  [TESTPOINT_2mm]  (value not drawn)
TP903  TESTPOINT  [TESTPOINT_2mm]  (value not drawn)
U900  LM2599  [TO263_7]
U901  LM3480  [SOT23]
U903  MSP430F20x2  [TSSOP14]
U904  DS1339  [uSOP8]
X900  32k768  [SMQ32S]
X901  32k768  [SMQ32S]
ZD900  P6SMB39A  [DO214AA]

### Ports
#POR (out, see 1), BOOTMODE (out, see 1), I2C_INT (out, see 5), I2C_SCL (bidir, see 3, 4, 6, 7), I2C_SDA (bidir, see 3, 4, 6, 7), IR_RXD (in, see 2), IR_TXD (out, see 2), KEY_COL1 (in, see 1), KEY_COL3 (in, see 1), KEY_ROW0 (out, see 1), KEY_ROW2 (out, see 1), LAN45 (in, see 8), LAN78 (in, see 8), OSC32KHZ (out, see 3), PLED (out, see 2), POWER_ON (out, see 1)

### Nets
3V3: C911.2 J901.2(VDD) U904.8(VCC)
5V: C914.3 C924.2 C925.2 C926.2 R903.2 R908.2
GND: B900.2(CATHODE) C900.2 C901.2 C902.2 C903.2 C904.1 C905.1 C906.2 C907.1 C908.2 C909.1 C910.1 C911.1 C912.1 C913.1 C914.2 C914.4 C917.2 C920.2 C923.2 C924.1 C925.1 C926.1 C927.1 C928.1 D903.2 H900.4 H902.3 J901.4(VSS) J901.6(VSS) J901.8(VSS) J901.10(VSS) J901.12(VSS) J901.14(VSS) J901.16(VSS) J901.18(VSS) J901.20(VSS) L908.1 P900.7(GND) R912.1 SW900.2 SW900.3 SW900.4 SW901.2 SW901.3 SW901.4 T901.2(S) U900.4(GND1) U900.8(GND2) U901.3(GND) U903.14(VSS) U904.4(GND)
VBUP: C905.2 C906.1 R901.2 R902.2 R902P.2 R907.2 TP903.1 U903.1(VCC) U904.3(VBAT)
VIN: C900.1 C901.1 C912.2 C917.1 L904.1 R900.1 TP900.1 U901.2(IN)
VIO: R909.2
VSB: C927.2 C928.2 D904.1 D904.2 R906.1 T900.1(G) U901.1(OUT)
#POR: C913.2 R908.1 SW901.1 ; port #POR
#POWER_EN: R912.2 T901.1(G) U903.5(P1.3)
BOOTMODE: H902.2 ; port BOOTMODE
I2C_INT: U903.7(P1.5) ; port I2C_INT
I2C_SCL: U903.8(P1.6/SCL) U904.6(SCL) ; port I2C_SCL
I2C_SDA: U903.9(P1.7/SDA) U904.5(SDA) ; port I2C_SDA
IR_RXD: U903.4(P1.2) ; port IR_RXD
IR_TXD: U903.3(P1.1) ; port IR_TXD
JTAG_SRST: J901.15(*SRST) P900.1(~{SRST})
JTAG_TCK: J901.9(TCK) P900.4(TCK)
JTAG_TDI: J901.5(TDI) P900.2(TDI)
JTAG_TDO: J901.13(TDO) P900.3(TDO)
JTAG_TMS: J901.7(TMS) P900.6(TMS)
JTAG_TRST: J901.3(*TRST) P900.5(~{TRST})
JTAG_VREF: J901.1(VREF) P900.8(VREF)
KEY_COL1: D902.3 ; port KEY_COL1
KEY_COL3: D905.3 ; port KEY_COL3
KEY_ROW0: SW902.1 SW902.3 SW904.1 SW904.3 ; port KEY_ROW0
KEY_ROW2: SW903.1 SW903.3 SW905.1 SW905.3 ; port KEY_ROW2
LAN45: L900.1 ; port LAN45
LAN78: L902.1 ; port LAN78
OSC32KHZ: U904.7(SQW) ; port OSC32KHZ
P1: C919.1 J900.2 L905.4
P2: C919.2 J900.1 J900.3 L905.1
P3: C915.1 L903.2 L905.3
P4: C915.2 L905.2 L907.2
P5: C916.1 D901.1 L903.1
P6: C916.2 C918.2 C921.2 L907.1 L908.2 L909.2 ZD900.2
P7: C918.1 D900.2 D901.2 L904.2 ZD900.1
P8: C921.1 D900.1 L909.3
P9: C922.1 L900.2 L909.4
P10: C922.2 L902.2 L909.1
P12: C902.1 C920.1 C923.1 L901.2 L906.2 U900.6(FB)
P13: D903.1 L901.1 U900.2(OUT)
P14: C914.1 L906.1
P15: R900.2 TP901.1 U900.1(VIN)
PLED: U903.2(P1.0) ; port PLED
POWER_OK: R906.2 T900.2(S) U903.6(P1.4)
POWER_ON: R903.1 T900.3(D) U900.3(POK/~{ERR}) ; port POWER_ON
SBWCK: R904.2 U903.11(TEST/SBWCK)
SBWIO: C908.1 R902.1 R902P.1 R905.2 SW900.1 U903.10(~{RST}/NMI/SBWIO)
NetB900_1: B900.1(ANODE) C903.1 D904.3 R907.1 TP902.1
NetC904_2: C904.2 T901.3(D) U900.7(~{SD}/SS)
NetC907_2: C907.2 U900.5(DELAY)
NetC909_2: C909.2 U903.13(XIN) X900.1
NetC910_2: C910.2 U903.12(XOUT) X900.2
NetD902_1: D902.1 SW902.2 SW902.4
NetD902_2: D902.2 SW903.2 SW903.4
NetD905_1: D905.1 SW904.2 SW904.4
NetD905_2: D905.2 SW905.2 SW905.4
NetH900_1: H900.1 R901.1
NetH900_2: H900.2 R904.1
NetH900_3: H900.3 R905.1
NetH902_1: H902.1 R909.1
NetU904_1: U904.1(X1) X901.2
NetU904_2: U904.2(X2) X901.1

Not connected (* = marked no-connect by the designer): J901 11(RTCK)* 17(DBGRQ)* 19(DBGACK)*

### Notes on the sheet
- 1 [mA] = 10 * U [mV]
- (near J900) INPUT VOLTAGE: 7-30V
- I2C: #68 [ 1 1 0 1 0 0 0 RW ]
- (near H902) BOOTMODE
  0	Internal Boot	Executing ROM code
  1	Serial Boot	USB/UART
- Designed By
- Checked By
- Company:
- Size:
- A3
- Address:
- Sheet:
- /

### Library data of the parts
B900 = BATT3V
C900-C903 C919 C923 = C+
C904-C913 C915-C918 C920-C922 C924-C928 = C
C914 = NFL21S: Chip EMIFIL; Producer: Murata; Order number: NFM18PC105R0J3; Component class: C; Assembly type: SMT
D900 D901 = D
D903 = SHD
H902 = H3
J901 = ARMICE20
L900 L902 L904 L908 = FBEAD
L901 = L
L903 L906 L907 = 7427512: 5A EMI ferit L; Producer: Wurth Electronic; Order number: 7427512; Component class: L; Assembly type: SMT
L905 = 42H17: Current compensated choke 2x10mH/700mA; Producer: Epcos; Component class: L; Assembly type: TH; Order number: B82721A2701N20
L909 = DLW5BSN152SQ2L: EMI Suppression filter 1A; Producer: Murata; Component class: L; Assembly type: SMT; Order number: DLW5BSN302SQ2L
R900-R902 R902P R903-R909 R912 = R
SW900-SW905 = PBSW
TP900-TP903 = TESTPOINT: as TP600-TP605 on sheet [08] MMC SLOT; Component class: TP; Producer: n/a; Assembly type: no component
X900 X901 = XTAL
ZD900 = ZD

## Sheet [12] - DOC REVISION HISTORY.SchDoc
size A3; CompanyName: FPT-FTI copporation; Address1: FPT Building Duy Tan; Address2: Floor 4,; DocumentNumber: 13; SheetNumber: 13; SheetTotal: 13; NameAuthor: Angle Vu
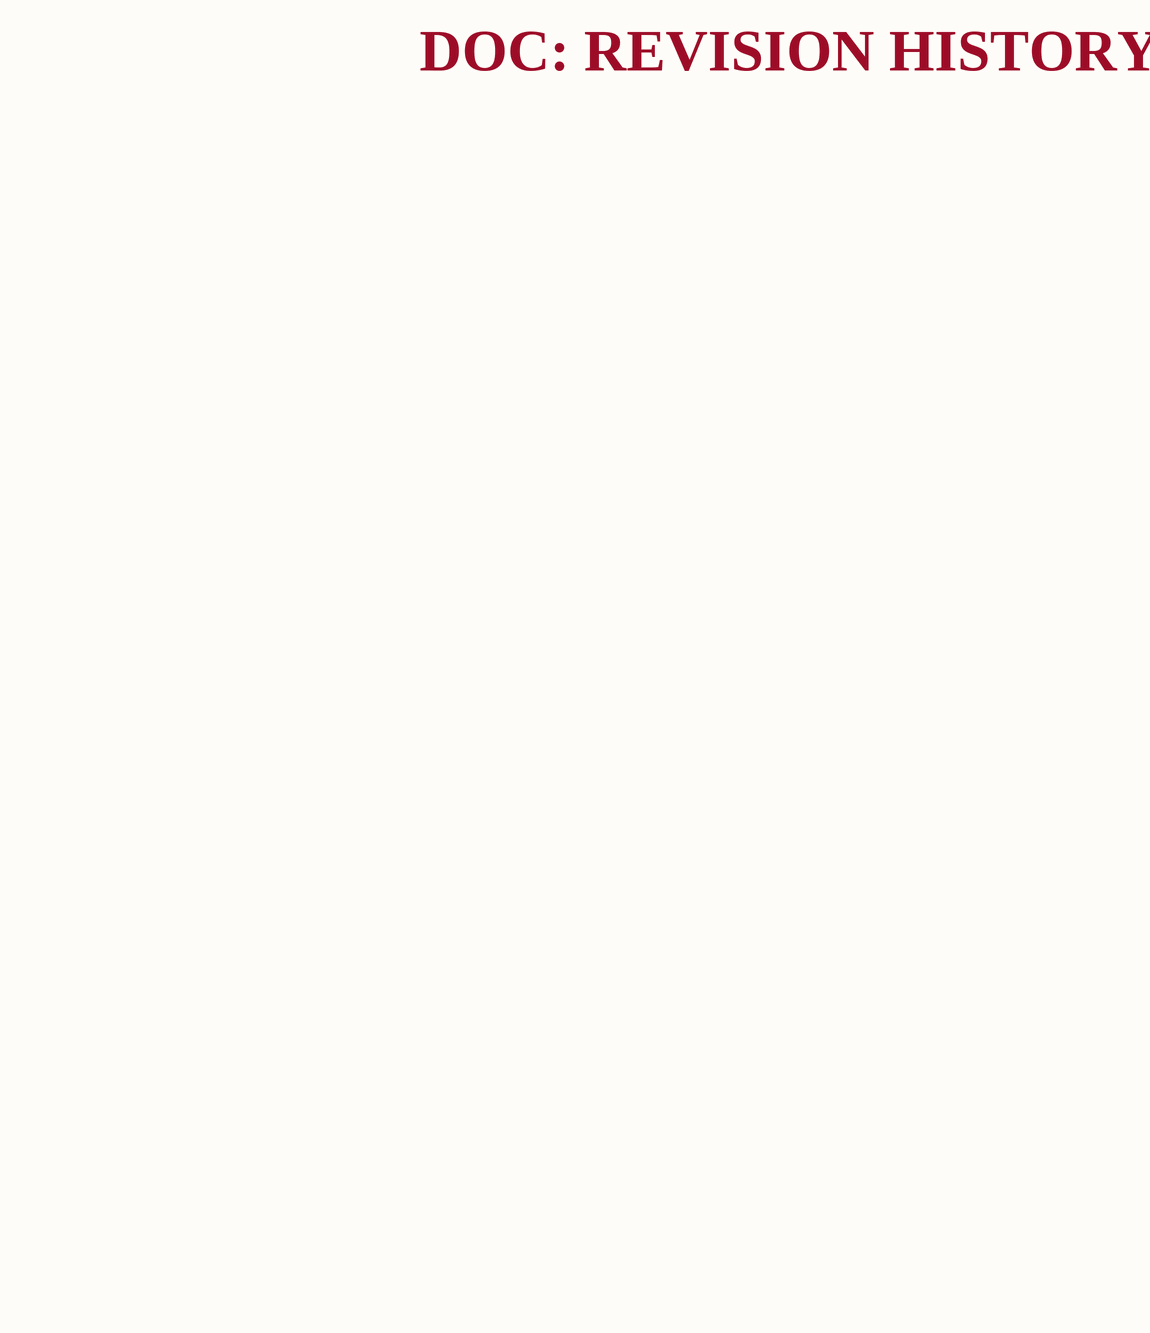
[diagram p12: [12] - DOC REVISION HISTORY.SchDoc]

### Notes on the sheet
- DOC: REVISION HISTORY
- CLOCKS (CPU & PCIE)
- Designed By
- Checked By
- Company:
- Size:
- A3
- Address:
- Sheet:
- /

## Nets that join several sheets
3V3: [03] - DIMM CON (12 pins), [04] - LCD, VGA (R200.1 TP200.1), [05] - AUDIO (R300.1 TP300.1), [06] - USB (R400.1 TP400.1), [07] - RS232 (R500.1 R501.1 TP500.1 TP502.1), [08] MMC SLOT (6 pins), [09] - DVI (8 pins), [10] - ETHERNET (R800.1 TP800.1), [11] - POWERS (C911.2 J901.2 U904.8)
5V: [03] - DIMM CON (6 pins), [04] - LCD, VGA (12 pins), [05] - AUDIO (C333.2 C334.2 U303.1 U303.3), [06] - USB (7 pins), [09] - DVI (5 pins), [10] - ETHERNET (5 pins), [11] - POWERS (6 pins)
GND: [03] - DIMM CON (55 pins), [04] - LCD, VGA (55 pins), [05] - AUDIO (36 pins), [06] - USB (55 pins), [07] - RS232 (30 pins), [08] MMC SLOT (61 pins), [09] - DVI (49 pins), [10] - ETHERNET (17 pins), [11] - POWERS (52 pins)
PHY_VDDA: [03] - DIMM CON (H103.5 K100.22), [10] - ETHERNET (J801.10 J801.12 R812.2)
VBUP: [03] - DIMM CON (H101.3 K100.13), [05] - AUDIO (U304.7), [11] - POWERS (9 pins)
VIO: [03] - DIMM CON (8 pins), [04] - LCD, VGA (12 pins), [05] - AUDIO (C300.2 R321.1 U300.2 U300.10), [06] - USB (R401.1 R405.1), [07] - RS232 (9 pins), [08] MMC SLOT (13 pins), [09] - DVI (C710.2 R719.1 R720.1 U702.2), [11] - POWERS (R909.2)
VSB: [04] - LCD, VGA (5 pins), [11] - POWERS (7 pins)
#CAN_CS_3V3: [07] - RS232 (U503.13), [10] - ETHERNET (U800.16)
#CAN_INT_3V3: [07] - RS232 (U500.9), [10] - ETHERNET (U800.12)
#PENIRQ_3V3: [05] - AUDIO (U304.11), [07] - RS232 (U500.10)
#POR: [03] - DIMM CON (H103.4 K100.16), [11] - POWERS (C913.2 R908.1 SW901.1)
#RESET_OUT: [03] - DIMM CON (H101.4 K100.15), [07] - RS232 (U506.14)
#RESET_OUT_3V3: [05] - AUDIO (U302.5), [06] - USB (R410.2), [07] - RS232 (H501.2 U506.10), [09] - DVI (R711.1), [10] - ETHERNET (R820.2)
#TOUCH_CS_3V3: [05] - AUDIO (U304.15), [07] - RS232 (U503.12)
#USBH1_OC: [03] - DIMM CON (H102.8 K100.28), [06] - USB (R405.2)
#USBO_OC: [03] - DIMM CON (H102.10 K100.36), [06] - USB (R401.2 U400.2 U400.3)
BIAS: [04] - LCD, VGA (H200.27 RN206.5 U201.11), [09] - DVI (U700.2)
BOOTMODE: [03] - DIMM CON (H103.2 K100.8), [11] - POWERS (H902.2)
CSPI1_MISO: [03] - DIMM CON (H101.12 K100.47), [07] - RS232 (U503.5)
CSPI1_MISO_3V3: [05] - AUDIO (U304.12), [07] - RS232 (H501.7 U503.16), [08] MMC SLOT (U600.2), [10] - ETHERNET (U800.15)
CSPI1_MOSI: [03] - DIMM CON (H103.11 K100.46), [07] - RS232 (U503.4)
CSPI1_MOSI_3V3: [05] - AUDIO (U304.14), [07] - RS232 (H501.8 U503.17), [08] MMC SLOT (U600.5), [10] - ETHERNET (U800.14)
CSPI1_RDY: [03] - DIMM CON (H100.13 K100.49), [07] - RS232 (U503.7)
CSPI1_RDY_3V3: [05] - AUDIO (U304.13), [07] - RS232 (H501.5 U503.14)
CSPI1_SCLK: [03] - DIMM CON (H103.12 K100.48), [07] - RS232 (U503.6)
CSPI1_SCLK_3V3: [05] - AUDIO (U304.16), [07] - RS232 (H501.10 U503.15), [08] MMC SLOT (U600.6), [10] - ETHERNET (U800.13)
CSPI1_SS0: [03] - DIMM CON (H102.12 K100.44), [07] - RS232 (U503.1)
CSPI1_SS0_3V3: [07] - RS232 (H501.3 U503.20), [08] MMC SLOT (R626.1)
CSPI1_SS1: [03] - DIMM CON (H101.11 K100.45), [07] - RS232 (U503.3)
CSPI1_SS1_3V3: [07] - RS232 (H501.4 U503.18), [08] MMC SLOT (R627.1)
DISP1_DAT0: [03] - DIMM CON (H101.29 K100.117), [04] - LCD, VGA (U200.3)
DISP1_DAT1: [03] - DIMM CON (H103.29 K100.118), [04] - LCD, VGA (U200.4)
DISP1_DAT2: [03] - DIMM CON (H101.30 K100.119), [04] - LCD, VGA (U200.5)
DISP1_DAT3: [03] - DIMM CON (H103.30 K100.120), [04] - LCD, VGA (U200.6)
DISP1_DAT4: [03] - DIMM CON (H100.31 K100.121), [04] - LCD, VGA (U200.7)
DISP1_DAT5: [03] - DIMM CON (H102.31 K100.122), [04] - LCD, VGA (U200.8)
DISP1_DAT6: [03] - DIMM CON (H100.32 K100.123), [04] - LCD, VGA (U200.9)
DISP1_DAT7: [03] - DIMM CON (H102.32 K100.124), [04] - LCD, VGA (U200.10)
DISP1_DAT8: [03] - DIMM CON (H101.31 K100.125), [04] - LCD, VGA (U203.3)
DISP1_DAT9: [03] - DIMM CON (H103.31 K100.126), [04] - LCD, VGA (U203.4)
DISP1_DAT10: [03] - DIMM CON (H101.32 K100.127), [04] - LCD, VGA (U203.5)
DISP1_DAT11: [03] - DIMM CON (H103.32 K100.128), [04] - LCD, VGA (U203.6)
DISP1_DAT12: [03] - DIMM CON (H102.33 K100.130), [04] - LCD, VGA (U203.7)
DISP1_DAT13: [03] - DIMM CON (H100.34 K100.131), [04] - LCD, VGA (U203.8)
DISP1_DAT14: [03] - DIMM CON (H102.34 K100.132), [04] - LCD, VGA (U203.9)
DISP1_DAT15: [03] - DIMM CON (H101.33 K100.133), [04] - LCD, VGA (U203.10)
DISP1_DAT16: [03] - DIMM CON (H103.33 K100.134), [04] - LCD, VGA (U205.3)
DISP1_DAT17: [03] - DIMM CON (H101.34 K100.135), [04] - LCD, VGA (U205.4)
DISP1_DAT18: [03] - DIMM CON (H103.34 K100.136), [04] - LCD, VGA (U205.5)
DISP1_DAT19: [03] - DIMM CON (H100.35 K100.137), [04] - LCD, VGA (U205.6)
DISP1_DAT20: [03] - DIMM CON (H102.35 K100.138), [04] - LCD, VGA (U205.7)
DISP1_DAT21: [03] - DIMM CON (H100.36 K100.139), [04] - LCD, VGA (U205.8)
DISP1_DAT22: [03] - DIMM CON (H102.36 K100.140), [04] - LCD, VGA (U205.9)
DISP1_DAT23: [03] - DIMM CON (H101.35 K100.141), [04] - LCD, VGA (U205.10)
DISP1_HSYNC: [03] - DIMM CON (H101.36 K100.143), [04] - LCD, VGA (U207.4)
DISP1_OE_ACD: [03] - DIMM CON (H100.37 K100.145), [04] - LCD, VGA (U207.6)
DISP1_SCLK: [03] - DIMM CON (H102.37 K100.146), [04] - LCD, VGA (U207.5)
DISP1_VSYNC: [03] - DIMM CON (H103.36 K100.144), [04] - LCD, VGA (U207.3)
FCLK: [04] - LCD, VGA (H200.4 RN206.8 U206.3), [09] - DVI (U700.5)
HSI2C_CLK: [03] - DIMM CON (H100.11 K100.41), [09] - DVI (R719.2 U702.3)
HSI2C_DAT: [03] - DIMM CON (H103.10 K100.40), [09] - DVI (R720.2 U702.4)
I2C_INT: [07] - RS232 (U500.8), [11] - POWERS (U903.7)
I2C_SCL: [05] - AUDIO (U301.29 U302.7), [06] - USB (R417.2), [08] MMC SLOT (U601.6), [09] - DVI (5 pins), [11] - POWERS (U903.8 U904.6)
I2C_SDA: [05] - AUDIO (U301.27 U302.8), [06] - USB (R416.2), [08] MMC SLOT (U601.5), [09] - DVI (5 pins), [11] - POWERS (U903.9 U904.5)
IR_RXD: [04] - LCD, VGA (R211.2 T203.2 U208.4), [11] - POWERS (U903.4)
IR_TXD: [04] - LCD, VGA (U208.3), [11] - POWERS (U903.3)
KEY_COL1: [03] - DIMM CON (H100.19 K100.73), [11] - POWERS (D902.3)
KEY_COL3: [03] - DIMM CON (H100.20 K100.75), [11] - POWERS (D905.3)
KEY_ROW0: [03] - DIMM CON (H101.19 K100.77), [11] - POWERS (SW902.1 SW902.3 SW904.1 SW904.3)
KEY_ROW2: [03] - DIMM CON (H101.20 K100.79), [11] - POWERS (SW903.1 SW903.3 SW905.1 SW905.3)
LAN45: [10] - ETHERNET (J801.4 J801.5 R817.2), [11] - POWERS (L900.1)
LAN78: [10] - ETHERNET (J801.7 J801.8 R818.2), [11] - POWERS (L902.1)
LCLK: [04] - LCD, VGA (H200.3 RN206.7 U206.1), [09] - DVI (U700.4)
LDD0: [04] - LCD, VGA (RN200.8 U201.16), [09] - DVI (U700.63)
LDD1: [04] - LCD, VGA (RN200.7 U201.17), [09] - DVI (U700.62)
LDD2: [04] - LCD, VGA (H200.20 RN200.6 U201.18), [09] - DVI (U700.61)
LDD3: [04] - LCD, VGA (H200.21 RN200.5 U201.19), [09] - DVI (U700.60)
LDD4: [04] - LCD, VGA (H200.22 RN201.8 U201.20), [09] - DVI (U700.59)
LDD5: [04] - LCD, VGA (H200.23 RN201.7 U201.21), [09] - DVI (U700.58)
LDD6: [04] - LCD, VGA (H200.24 RN201.6 U201.22), [09] - DVI (U700.55)
LDD7: [04] - LCD, VGA (H200.25 RN201.5 U201.23), [09] - DVI (U700.54)
LDD8: [04] - LCD, VGA (RN202.8 U201.3), [09] - DVI (U700.53)
LDD9: [04] - LCD, VGA (RN202.7 U201.4), [09] - DVI (U700.52)
LDD10: [04] - LCD, VGA (H200.13 RN202.6 U201.5), [09] - DVI (U700.51)
LDD11: [04] - LCD, VGA (H200.14 RN202.5 U201.6), [09] - DVI (U700.50)
LDD12: [04] - LCD, VGA (H200.15 RN203.8 U201.7), [09] - DVI (U700.47)
LDD13: [04] - LCD, VGA (H200.16 RN203.7 U201.8), [09] - DVI (U700.46)
LDD14: [04] - LCD, VGA (H200.17 RN203.6 U201.9), [09] - DVI (U700.45)
LDD15: [04] - LCD, VGA (H200.18 RN203.5 U201.10), [09] - DVI (U700.44)
LDD16: [04] - LCD, VGA (RN204.8 U201.41), [09] - DVI (U700.43)
LDD17: [04] - LCD, VGA (RN204.7 U201.42), [09] - DVI (U700.42)
LDD18: [04] - LCD, VGA (H200.6 RN204.6 U201.43), [09] - DVI (U700.41)
LDD19: [04] - LCD, VGA (H200.7 RN204.5 U201.44), [09] - DVI (U700.40)
LDD20: [04] - LCD, VGA (H200.8 RN205.8 U201.45), [09] - DVI (U700.39)
LDD21: [04] - LCD, VGA (H200.9 RN205.7 U201.46), [09] - DVI (U700.38)
LDD22: [04] - LCD, VGA (H200.10 RN205.6 U201.47), [09] - DVI (U700.37)
LDD23: [04] - LCD, VGA (H200.11 RN205.5 U201.48), [09] - DVI (U700.36)
OSC32KHZ: [05] - AUDIO (R307.1 U302.9), [11] - POWERS (U904.7)
OWIRE: [03] - DIMM CON (H100.12 K100.43), [08] MMC SLOT (R614.2 U602.1)
PCLK: [04] - LCD, VGA (H200.2 RN206.6 U201.24), [09] - DVI (U700.57)
PHY_ACT: [03] - DIMM CON (H103.6 K100.24), [10] - ETHERNET (R816.1)
PHY_LINK: [03] - DIMM CON (H102.6 K100.20), [10] - ETHERNET (R813.1)
PHY_RXN: [03] - DIMM CON (K100.23), [10] - ETHERNET (TR800.9)
PHY_RXP: [03] - DIMM CON (K100.25), [10] - ETHERNET (TR800.11)
PHY_TXN: [03] - DIMM CON (K100.19), [10] - ETHERNET (TR800.14)
PHY_TXP: [03] - DIMM CON (K100.21), [10] - ETHERNET (TR800.16)
PLED: [04] - LCD, VGA (R212.1 T202.1), [11] - POWERS (U903.2)
POWER_ON: [03] - DIMM CON (H103.3 K100.14), [11] - POWERS (R903.1 T900.3 U900.3)
PSAVE: [04] - LCD, VGA (H200.29 RN207.5 U201.38), [09] - DVI (U700.10)
PWM: [03] - DIMM CON (H102.11 K100.42), [04] - LCD, VGA (U207.7)
SCR_RESET: [07] - RS232 (U506.9), [08] MMC SLOT (U604.28)
SCR_RXD: [07] - RS232 (U506.7), [08] MMC SLOT (R620.1)
SCR_TXD: [07] - RS232 (U500.7), [08] MMC SLOT (R621.1)
SD1_CD: [03] - DIMM CON (H100.14 K100.51), [08] MMC SLOT (J600.10 R619.2)
SD1_CLK: [03] - DIMM CON (H100.15 K100.57), [08] MMC SLOT (U603.3)
SD1_CMD: [03] - DIMM CON (H103.14 K100.56), [08] MMC SLOT (U603.1)
SD1_DATA0: [03] - DIMM CON (H102.14 K100.52), [08] MMC SLOT (U603.4)
SD1_DATA1: [03] - DIMM CON (H101.13 K100.53), [08] MMC SLOT (U603.5)
SD1_DATA2: [03] - DIMM CON (H103.13 K100.54), [08] MMC SLOT (U603.6)
SD1_DATA3: [03] - DIMM CON (H101.14 K100.55), [08] MMC SLOT (U603.7)
SD2_CD: [03] - DIMM CON (H101.24 K100.95), [08] MMC SLOT (J602.10 R632.2)
SD2_CLK: [03] - DIMM CON (H101.25 K100.101), [08] MMC SLOT (U605.3)
SD2_CMD: [03] - DIMM CON (H102.26 K100.100), [08] MMC SLOT (U605.1)
SD2_DATA0: [03] - DIMM CON (H103.24 K100.96), [08] MMC SLOT (U605.4)
SD2_DATA1: [03] - DIMM CON (H100.25 K100.97), [08] MMC SLOT (U605.5)
SD2_DATA2: [03] - DIMM CON (H102.25 K100.98), [08] MMC SLOT (U605.6)
SD2_DATA3: [03] - DIMM CON (H100.26 K100.99), [08] MMC SLOT (U605.7)
SSI1_CLK: [03] - DIMM CON (H103.21 K100.86), [05] - AUDIO (U300.7)
SSI1_FS: [03] - DIMM CON (H101.22 K100.87), [05] - AUDIO (U300.9)
SSI1_RXD: [03] - DIMM CON (H102.22 K100.84), [05] - AUDIO (U300.8)
SSI1_TXD: [03] - DIMM CON (H101.21 K100.85), [05] - AUDIO (U300.6)
SSI2_CLK: [03] - DIMM CON (H102.24 K100.92), [05] - AUDIO (U300.4)
SSI2_FS: [03] - DIMM CON (H101.23 K100.93), [05] - AUDIO (U300.3)
SSI2_INT: [03] - DIMM CON (H100.23 K100.89), [05] - AUDIO (U300.5)
SSI2_RXD: [03] - DIMM CON (H102.23 K100.90), [05] - AUDIO (U300.1)
TSMX: [04] - LCD, VGA (H200.37), [05] - AUDIO (R303.2)
TSMY: [04] - LCD, VGA (H200.38), [05] - AUDIO (R302.2)
TSPX: [04] - LCD, VGA (H200.39), [05] - AUDIO (R301.2)
TSPY: [04] - LCD, VGA (H200.40), [05] - AUDIO (R304.2)
UART1_CTS: [03] - DIMM CON (H103.15 K100.62), [07] - RS232 (U506.18)
UART1_RTS: [03] - DIMM CON (H101.15 K100.61), [07] - RS232 (U500.18)
UART1_RXD: [03] - DIMM CON (H102.16 K100.60), [07] - RS232 (U500.19)
UART1_TXD: [03] - DIMM CON (H100.16 K100.59), [07] - RS232 (U506.19)
UART2_CTS: [03] - DIMM CON (H102.17 K100.66), [07] - RS232 (U506.20)
UART2_RTS: [03] - DIMM CON (H100.17 K100.65), [07] - RS232 (U500.20)
UART2_RXD: [03] - DIMM CON (H103.16 K100.64), [07] - RS232 (U500.21)
UART2_TXD: [03] - DIMM CON (H101.16 K100.63), [07] - RS232 (U506.21)
UART3_RXD: [03] - DIMM CON (H102.18 K100.68), [07] - RS232 (U500.17)
UART3_TXD: [03] - DIMM CON (H100.18 K100.67), [07] - RS232 (U506.17)
USBH1_DM: [03] - DIMM CON (K100.29), [06] - USB (U403.30)
USBH1_DP: [03] - DIMM CON (K100.31), [06] - USB (U403.31)
USBH1_VBUS: [03] - DIMM CON (H103.7 K100.30), [06] - USB (R403.2)
USBO_DM: [03] - DIMM CON (K100.35), [06] - USB (B400.4 J400.2)
USBO_DP: [03] - DIMM CON (K100.37), [06] - USB (B400.2 J400.3)
USBO_ID: [03] - DIMM CON (H100.9 K100.33), [06] - USB (H401.2 J400.4)
USBO_PEN: [03] - DIMM CON (H102.9 K100.34), [07] - RS232 (U506.16)
USBO_PEN_3V3: [06] - USB (U400.1 U400.4), [07] - RS232 (U506.8)
USBO_VBUS: [03] - DIMM CON (H103.9 K100.38), [06] - USB (R402.2)
VGA_BLUE: [04] - LCD, VGA (R205.2 U201.28), [09] - DVI (J700.C3)
VGA_GREEN: [04] - LCD, VGA (R204.2 U201.32), [09] - DVI (J700.C2)
VGA_HSYNC: [04] - LCD, VGA (C216.2 L204.2), [09] - DVI (J700.C4)
VGA_RED: [04] - LCD, VGA (R203.2 U201.34), [09] - DVI (J700.C1)
VGA_VSYNC: [04] - LCD, VGA (C217.2 L205.2), [09] - DVI (J700.8)